# Altium schematic sheet LED_Driver_and_LEDs_02.SchDoc
size A
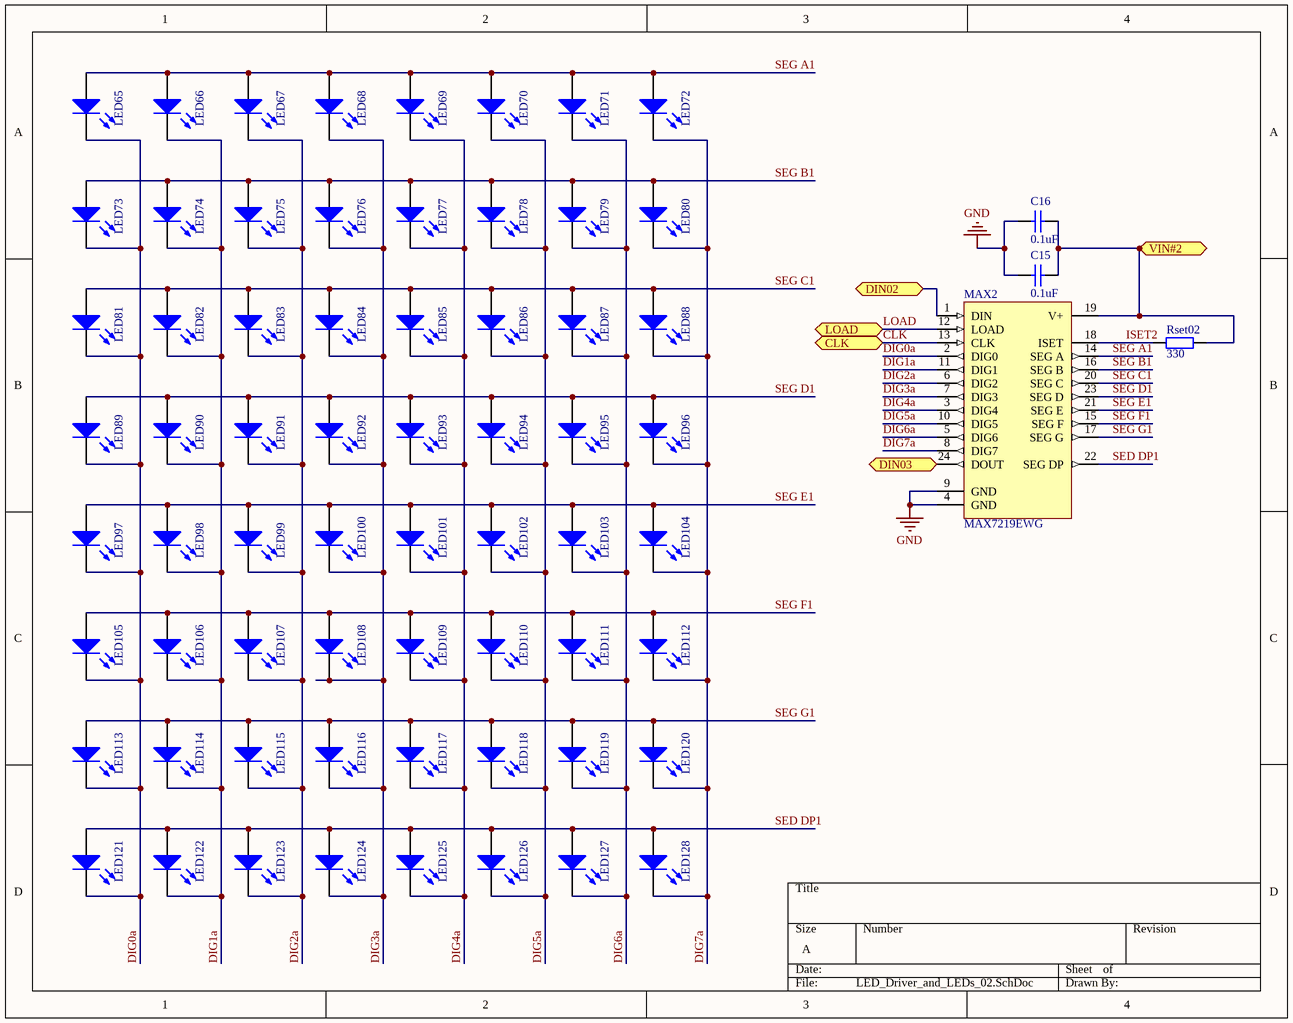
[diagram p0: LED_Driver_and_LEDs_02.SchDoc]

## Parts
C15  value 0.1uF  [6-0805_N]  (hidden comment: Cap Semi)
C16  value 0.1uF  [6-0805_N]  (hidden comment: Cap Semi)
LED65  LED3  [3.5X2.8X1.9]  (value not drawn)
LED66  LED3  [3.5X2.8X1.9]  (value not drawn)
LED67  LED3  [3.5X2.8X1.9]  (value not drawn)
LED68  LED3  [3.5X2.8X1.9]  (value not drawn)
LED69  LED3  [3.5X2.8X1.9]  (value not drawn)
LED70  LED3  [3.5X2.8X1.9]  (value not drawn)
LED71  LED3  [3.5X2.8X1.9]  (value not drawn)
LED72  LED3  [3.5X2.8X1.9]  (value not drawn)
LED73  LED3  [3.5X2.8X1.9]  (value not drawn)
LED74  LED3  [3.5X2.8X1.9]  (value not drawn)
LED75  LED3  [3.5X2.8X1.9]  (value not drawn)
LED76  LED3  [3.5X2.8X1.9]  (value not drawn)
LED77  LED3  [3.5X2.8X1.9]  (value not drawn)
LED78  LED3  [3.5X2.8X1.9]  (value not drawn)
LED79  LED3  [3.5X2.8X1.9]  (value not drawn)
LED80  LED3  [3.5X2.8X1.9]  (value not drawn)
LED81  LED3  [3.5X2.8X1.9]  (value not drawn)
LED82  LED3  [3.5X2.8X1.9]  (value not drawn)
LED83  LED3  [3.5X2.8X1.9]  (value not drawn)
LED84  LED3  [3.5X2.8X1.9]  (value not drawn)
LED85  LED3  [3.5X2.8X1.9]  (value not drawn)
LED86  LED3  [3.5X2.8X1.9]  (value not drawn)
LED87  LED3  [3.5X2.8X1.9]  (value not drawn)
LED88  LED3  [3.5X2.8X1.9]  (value not drawn)
LED89  LED3  [3.5X2.8X1.9]  (value not drawn)
LED90  LED3  [3.5X2.8X1.9]  (value not drawn)
LED91  LED3  [3.5X2.8X1.9]  (value not drawn)
LED92  LED3  [3.5X2.8X1.9]  (value not drawn)
LED93  LED3  [3.5X2.8X1.9]  (value not drawn)
LED94  LED3  [3.5X2.8X1.9]  (value not drawn)
LED95  LED3  [3.5X2.8X1.9]  (value not drawn)
LED96  LED3  [3.5X2.8X1.9]  (value not drawn)
LED97  LED3  [3.5X2.8X1.9]  (value not drawn)
LED98  LED3  [3.5X2.8X1.9]  (value not drawn)
LED99  LED3  [3.5X2.8X1.9]  (value not drawn)
LED100  LED3  [3.5X2.8X1.9]  (value not drawn)
LED101  LED3  [3.5X2.8X1.9]  (value not drawn)
LED102  LED3  [3.5X2.8X1.9]  (value not drawn)
LED103  LED3  [3.5X2.8X1.9]  (value not drawn)
LED104  LED3  [3.5X2.8X1.9]  (value not drawn)
LED105  LED3  [3.5X2.8X1.9]  (value not drawn)
LED106  LED3  [3.5X2.8X1.9]  (value not drawn)
LED107  LED3  [3.5X2.8X1.9]  (value not drawn)
LED108  LED3  [3.5X2.8X1.9]  (value not drawn)
LED109  LED3  [3.5X2.8X1.9]  (value not drawn)
LED110  LED3  [3.5X2.8X1.9]  (value not drawn)
LED111  LED3  [3.5X2.8X1.9]  (value not drawn)
LED112  LED3  [3.5X2.8X1.9]  (value not drawn)
LED113  LED3  [3.5X2.8X1.9]  (value not drawn)
LED114  LED3  [3.5X2.8X1.9]  (value not drawn)
LED115  LED3  [3.5X2.8X1.9]  (value not drawn)
LED116  LED3  [3.5X2.8X1.9]  (value not drawn)
LED117  LED3  [3.5X2.8X1.9]  (value not drawn)
LED118  LED3  [3.5X2.8X1.9]  (value not drawn)
LED119  LED3  [3.5X2.8X1.9]  (value not drawn)
LED120  LED3  [3.5X2.8X1.9]  (value not drawn)
LED121  LED3  [3.5X2.8X1.9]  (value not drawn)
LED122  LED3  [3.5X2.8X1.9]  (value not drawn)
LED123  LED3  [3.5X2.8X1.9]  (value not drawn)
LED124  LED3  [3.5X2.8X1.9]  (value not drawn)
LED125  LED3  [3.5X2.8X1.9]  (value not drawn)
LED126  LED3  [3.5X2.8X1.9]  (value not drawn)
LED127  LED3  [3.5X2.8X1.9]  (value not drawn)
LED128  LED3  [3.5X2.8X1.9]  (value not drawn)
MAX2  MAX7219EWG  [WSO24_N]
Rset02  value 330  [J1-0603]  (hidden comment: Res2)

## Ports
CLK (bidir), DIN02 (bidir), DIN03 (out), LOAD (bidir), VIN#2 (in)

## Nets
GND: C15.2 C16.2 MAX2.4(GND) MAX2.9(GND)
CLK: MAX2.13(CLK) ; port CLK
DIG0a: LED65.2(K) LED73.2(K) LED81.2(K) LED89.2(K) LED97.2(K) LED105.2(K) LED113.2(K) LED121.2(K) MAX2.2(DIG0)
DIG1a: LED66.2(K) LED74.2(K) LED82.2(K) LED90.2(K) LED98.2(K) LED106.2(K) LED114.2(K) LED122.2(K) MAX2.11(DIG1)
DIG2a: LED67.2(K) LED75.2(K) LED83.2(K) LED91.2(K) LED99.2(K) LED107.2(K) LED115.2(K) LED123.2(K) MAX2.6(DIG2)
DIG3a: LED68.2(K) LED76.2(K) LED84.2(K) LED92.2(K) LED100.2(K) LED108.2(K) LED116.2(K) LED124.2(K) MAX2.7(DIG3)
DIG4a: LED69.2(K) LED77.2(K) LED85.2(K) LED93.2(K) LED101.2(K) LED109.2(K) LED117.2(K) LED125.2(K) MAX2.3(DIG4)
DIG5a: LED70.2(K) LED78.2(K) LED86.2(K) LED94.2(K) LED102.2(K) LED110.2(K) LED118.2(K) LED126.2(K) MAX2.10(DIG5)
DIG6a: LED71.2(K) LED79.2(K) LED87.2(K) LED95.2(K) LED103.2(K) LED111.2(K) LED119.2(K) LED127.2(K) MAX2.5(DIG6)
DIG7a: LED72.2(K) LED80.2(K) LED88.2(K) LED96.2(K) LED104.2(K) LED112.2(K) LED120.2(K) LED128.2(K) MAX2.8(DIG7)
DIN02: MAX2.1(DIN) ; port DIN02
DIN03: MAX2.24(DOUT) ; port DIN03
ISET2: MAX2.18(ISET) Rset02.2
LOAD: MAX2.12(LOAD) ; port LOAD
SED DP1: LED121.1(A) LED122.1(A) LED123.1(A) LED124.1(A) LED125.1(A) LED126.1(A) LED127.1(A) LED128.1(A) MAX2.22(SEG_DP)
SEG A1: LED65.1(A) LED66.1(A) LED67.1(A) LED68.1(A) LED69.1(A) LED70.1(A) LED71.1(A) LED72.1(A) MAX2.14(SEG_A)
SEG B1: LED73.1(A) LED74.1(A) LED75.1(A) LED76.1(A) LED77.1(A) LED78.1(A) LED79.1(A) LED80.1(A) MAX2.16(SEG_B)
SEG C1: LED81.1(A) LED82.1(A) LED83.1(A) LED84.1(A) LED85.1(A) LED86.1(A) LED87.1(A) LED88.1(A) MAX2.20(SEG_C)
SEG D1: LED89.1(A) LED90.1(A) LED91.1(A) LED92.1(A) LED93.1(A) LED94.1(A) LED95.1(A) LED96.1(A) MAX2.23(SEG_D)
SEG E1: LED97.1(A) LED98.1(A) LED99.1(A) LED100.1(A) LED101.1(A) LED102.1(A) LED103.1(A) LED104.1(A) MAX2.21(SEG_E)
SEG F1: LED105.1(A) LED106.1(A) LED107.1(A) LED108.1(A) LED109.1(A) LED110.1(A) LED111.1(A) LED112.1(A) MAX2.15(SEG_F)
SEG G1: LED113.1(A) LED114.1(A) LED115.1(A) LED116.1(A) LED117.1(A) LED118.1(A) LED119.1(A) LED120.1(A) MAX2.17(SEG_G)
VIN#2: C15.1 C16.1 MAX2.19(V+) Rset02.1 ; port VIN#2

## Library data of the parts
C15 C16 = Cap Semi: Capacitor (Semiconductor SIM Model); Published: 8-Jun-2000; LatestRevisionDate: 29-May-2009; LatestRevisionNote: IPC-7351 Footprint Added.; PackageReference: C1206; Publisher: Altium Limited; PackageDescription: Chip Capacitor
LED65-LED128 = LED3: Typical BLUE SiC LED; Published: 8-Jun-2000; LatestRevisionDate: 17-Dec-2003; LatestRevisionNote: PCB Footprint replaced.; DatasheetVersion: 16-Apr-2002; PackageVersion: 16-Apr-2002; PackageReference: 3.5X2.8X1.9; Publisher: Altium Limited; PackageDescription: SM LED; 2 C-Bend Leads; Body 3.5 x 2.8 x 1.9 mm, inc leads (LxWxH typ)
MAX2 = MAX7219EWG: Serially Interfaced, 8-Digit LED Display Driver; Published: 16-Jan-2001; LatestRevisionDate: 13-Apr-2006; LatestRevisionNote: IPC-7351 Footprint Added.; DatasheetVersion: Jul-1997; PackageReference: WSO24; Publisher: Altium Limited; PackageDescription: 24-Pin Small Outline Integrated Circuit 1.27 mm Pitch; ComponentLink1Description: Manufacturer Link; ComponentLink1URL: http://www.maxim-ic.com/; ComponentLink2Description: Datasheet; ComponentLink2URL: http://pdfserv.maxim-ic.com/en/ds/MAX7219-MAX7221.pdf
Rset02 = Res2: Resistor; Published: 8-Jun-2000; LatestRevisionDate: 17-Jul-2002; LatestRevisionNote: Re-released for DXP Platform.; PackageReference: AXIAL-0.4; Publisher: Altium Limited; PackageDescription: Axial Device, Thru-Hole; 2 Leads; 0.4 in Pin Spacing